# EAGLE schematic LR_meter (EAGLE 9.0.1)
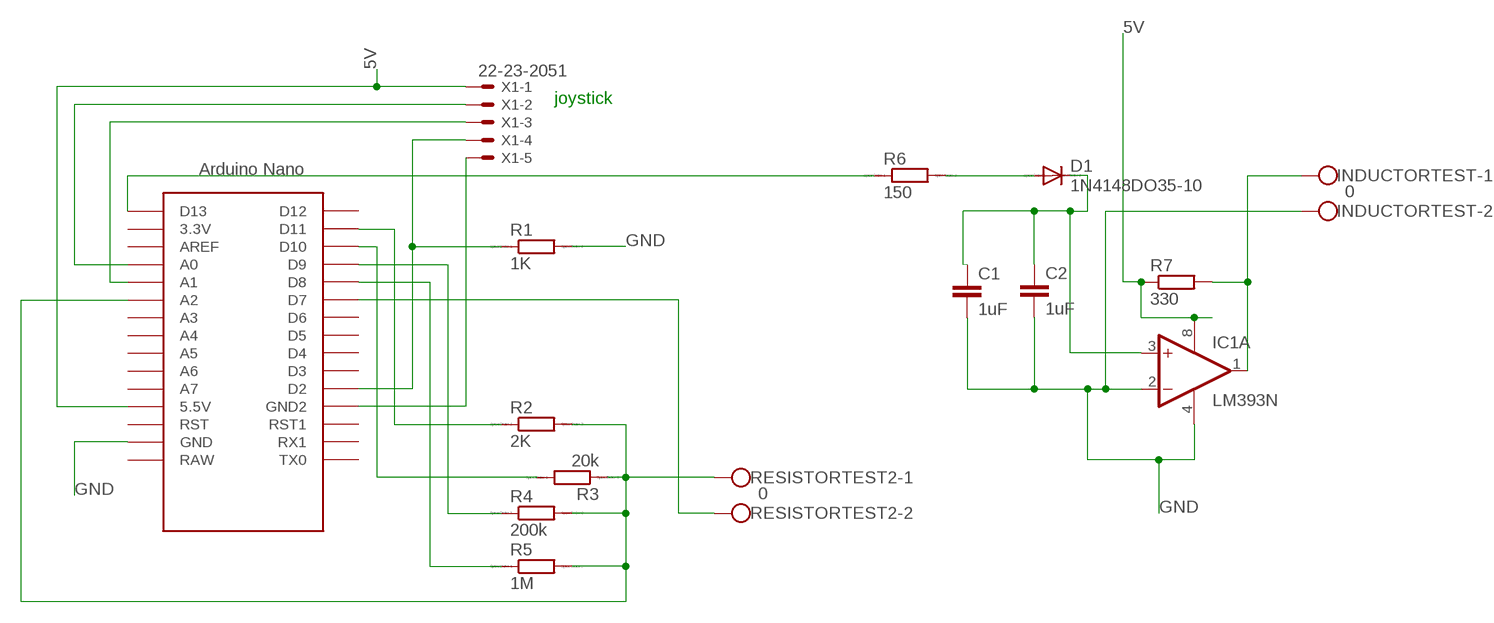
[diagram p0: schematic, sheet 1]

## Parts
C1  1uF  C5/2.5  [C5B2.5]
C2  1uF  C5/2.5  [C5B2.5]
D1  1N4148DO35-10  [DO35-10]
IC1  LM393N  [DIL08]
INDUCTORTEST  0  W237-102  [W237-102]
R1  1K  R0207/10  [0207/10]
R2  2K  R0207/10  [0207/10]
R3  20k  R0207/10  [0207/10]
R4  200k  R0207/10  [0207/10]
R5  1M  R0207/10  [0207/10]
R6  150  R0207/10  [0207/10]
R7  330  R-EU_0207/15  [0207/15]
RESISTORTEST2  0  W237-102  [W237-102]
U$1  NANO  [NANO]
X1  22-23-2051  [22-23-2051]

## Nets
5V: IC1.8(P:V+) R7.1 U$1.5V(5.5V) X1.1
GND: C1.2 C2.2 IC1.2(A:-IN) IC1.4(P:V-) INDUCTORTEST.2 R1.2 U$1.GND
N$2: U$1.A0 X1.2
N$3: U$1.A1 X1.3
N$4: R1.1 U$1.D2 X1.4
N$5: U$1.GND1(GND2) X1.5
N$6: R2.1 U$1.D11
N$7: R3.2 U$1.D10
N$8: R4.1 U$1.D9
N$9: R5.1 U$1.D8
N$11: RESISTORTEST2.2 U$1.D7
N$12: R6.1 U$1.D13
N$13: C1.1 C2.1 D1.C IC1.3(A:+IN)
N$14: D1.A R6.2
N$15: IC1.1(A:OUT) INDUCTORTEST.1 R7.2
N$30: R2.2 R3.1 R4.2 R5.2 RESISTORTEST2.1 U$1.A2
Unconnected: IC1.5(B:+IN) IC1.6(B:-IN) IC1.7(B:OUT) U$1.3.3V U$1.A3 U$1.A4 U$1.A5 U$1.A6 U$1.A7 U$1.AREF U$1.D3 U$1.D4 U$1.D5 U$1.D6 U$1.D12 U$1.ICSP1 U$1.ICSP2 U$1.ICSP3 U$1.ICSP4 U$1.ICSP5 U$1.ICSP6 U$1.RAW U$1.RST U$1.RST1 U$1.RX1 U$1.TX0

## Notes on the sheet
- joystick

## Library data of the parts
C1 C2 = capacitor-wima:C: CAPACITOR naming: grid - package width
D1 = diode:1N4148: DIODE high speed (Philips)
IC1 = linear:LM393: COMPARATOR
INDUCTORTEST RESISTORTEST2 = con-wago-500:W237-102: WAGO SCREW CLAMP; MPN: 237-102; OC_FARNELL: unknown; OC_NEWARK: 70K9898
R1-R6 = eagle-ltspice:R: RESISTOR, European symbol; SPICEMODEL: NONE; SPICEPREFIX: R
R7 = resistor:R-EU_: RESISTOR, European symbol
U$1 = Arduino-clone:NANO: Arduino Nano
X1 = con-molex:22-23-2051: .100" (2.54mm) Center Header - 5 Pin; MF: MOLEX; MPN: 22-23-2051; OC_FARNELL: 1462952; OC_NEWARK: 38C9178